# EAGLE design Nano_gies (EAGLE 7.1.0)
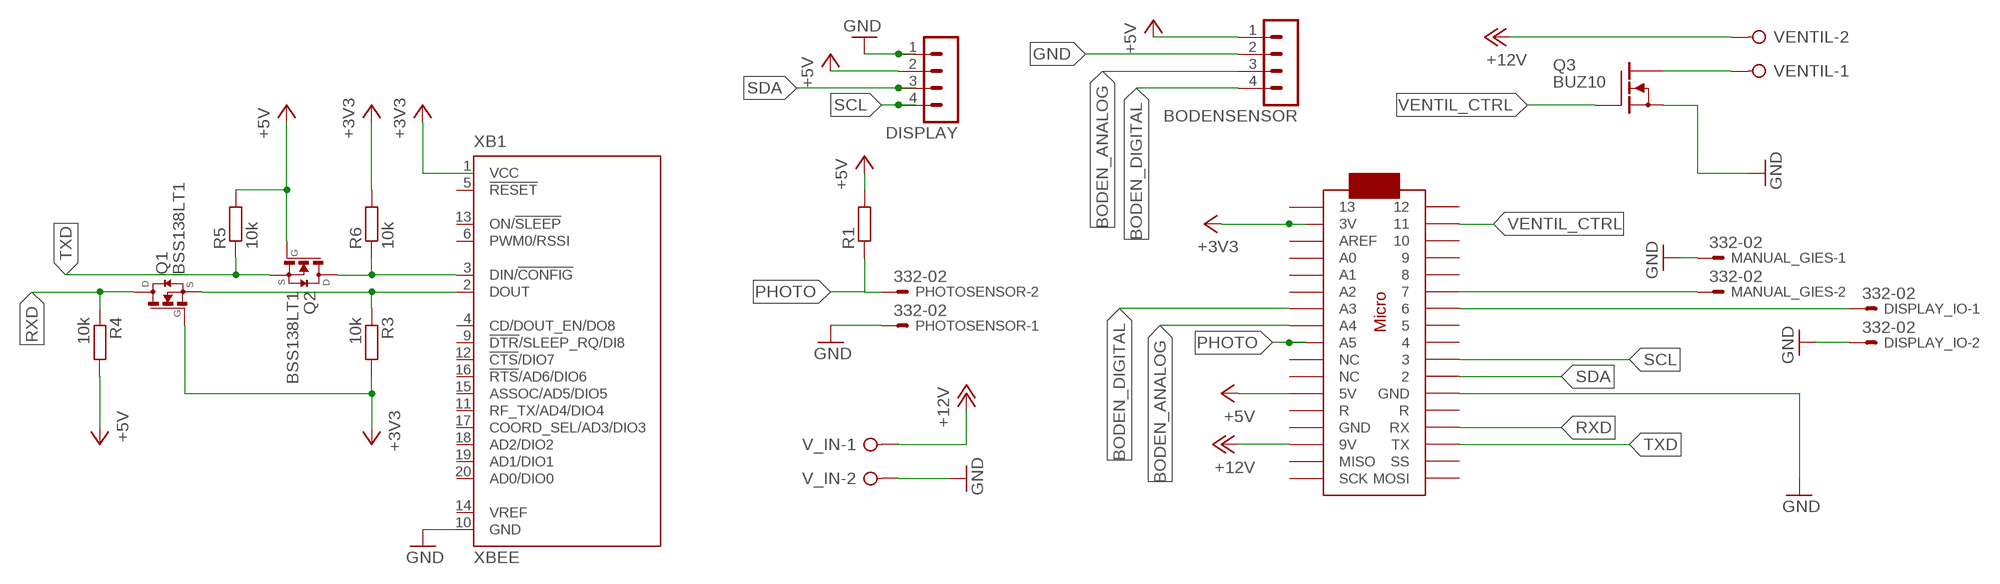
[diagram p0: schematic, sheet 1]

## Parts
BODENSENSOR  MA04-1  [MA04-1]
DISPLAY  MA04-1  [MA04-1]
DISPLAY_IO  332-02  [332-02]
MANUAL_GIES  332-02  [332-02]
PHOTOSENSOR  332-02  [332-02]
Q1  BSS138LT1  [SOT23]
Q2  BSS138LT1  [SOT23]
Q3  BUZ10  [TO220]
R1  R-EU_M0805  [M0805]
R3  10k  R-EU_M0805  [M0805]
R4  10k  R-EU_M0805  [M0805]
R5  10k  R-EU_M0805  [M0805]
R6  10k  R-EU_M0805  [M0805]
U$1  ARDUINOMICRO  [ARDUINOMICRO]
V_IN  W237-02P  [W237-132]
VENTIL  W237-02P  [W237-132]
XB1  XBEE  [XBEE]

## Nets
+3V3: Q1.1(G) R3.2 R6.2 U$1.P$33(3V) XB1.1(VCC)
+5V: BODENSENSOR.1 DISPLAY.2 Q2.1(G) R1.2 R4.2 R5.2 U$1.P$23(5V)
+12V: U$1.P$20(9V) V_IN.1 VENTIL.2
BODEN_ANALOG: BODENSENSOR.3 U$1.P$27(A4)
BODEN_DIGITAL: BODENSENSOR.4 U$1.P$28(A3)
GND: BODENSENSOR.2 DISPLAY.1 DISPLAY_IO.2 MANUAL_GIES.1 PHOTOSENSOR.1 Q3.3(S) U$1.P$21(GND) V_IN.2 XB1.10(GND)
N$1: MANUAL_GIES.2 U$1.P$6
N$2: Q1.2(S) R3.1 XB1.2(DOUT)
N$3: DISPLAY_IO.1 U$1.P$7
N$5: Q3.2(D) VENTIL.1
N$7: Q2.3(D) R6.1 XB1.3(DIN/!CONFIG)
PHOTO: PHOTOSENSOR.2 R1.1 U$1.P$26(A5)
RXD: Q1.3(D) R4.1 U$1.P$14(RX)
SCL: DISPLAY.4 U$1.P$10
SDA: DISPLAY.3 U$1.P$11
TXD: Q2.2(S) R5.1 U$1.P$15(TX)
VENTIL_CTRL: Q3.1(G) U$1.P$2
Unconnected: U$1.P$1 U$1.P$3 U$1.P$4 U$1.P$5 U$1.P$8 U$1.P$9 U$1.P$12(GND) U$1.P$13(R) U$1.P$16(SS) U$1.P$17(MOSI) U$1.P$18(SCK) U$1.P$19(MISO) U$1.P$22(R) U$1.P$24(NC) U$1.P$25(NC) U$1.P$29(A2) U$1.P$30(A1) U$1.P$31(A0) U$1.P$32(AREF) U$1.P$34 XB1.4(CD/DOUT_EN/DO8) XB1.5(!RESET) XB1.6(PWM0/RSSI) XB1.9(!DTR!/SLEEP_RQ/DI8) XB1.11(RF_TX/AD4/DIO4) XB1.12(!CTS!/DIO7) XB1.13(ON/!SLEEP) XB1.14(VREF) XB1.15(ASSOC/AD5/DIO5) XB1.16(!RTS!/AD6/DIO6) XB1.17(COORD_SEL/AD3/DIO3) XB1.18(AD2/DIO2) XB1.19(AD1/DIO1) XB1.20(AD0/DIO0)

## Library data of the parts
BODENSENSOR DISPLAY = con-lstb:MA04-1: PIN HEADER; OC_FARNELL: unknown; OC_NEWARK: unknown
DISPLAY_IO MANUAL_GIES PHOTOSENSOR = con-garry:332-02: 2 Pin - 2mm Dual Row Source: www.mpe-connector.de / garry_shortform_2012.pdf
Q1 Q2 = transistor-fet:BSS138*: Power MOSFET
Q3 = transistor-fet:BUZ10: N-Channel Enhancement MOSFET
R1 R3-R6 = rcl:R-EU_: RESISTOR, European symbol
U$1 = adafruit:ARDUINOMICRO
V_IN VENTIL = con-wago-508:W237-02P: WAGO SREW CLAMP; OC_FARNELL: unknown; OC_NEWARK: unknown
XB1 = maxstream:XBEE: XBee (TM) /XBee-PRO(TM) OEM RF Modules Source: MaxStream, Inc. xbee_productmanual.pdf; MPN: XBP24-Z7UIT-004; OC_FARNELL: 1751799; OC_NEWARK: 34R5507

## Board
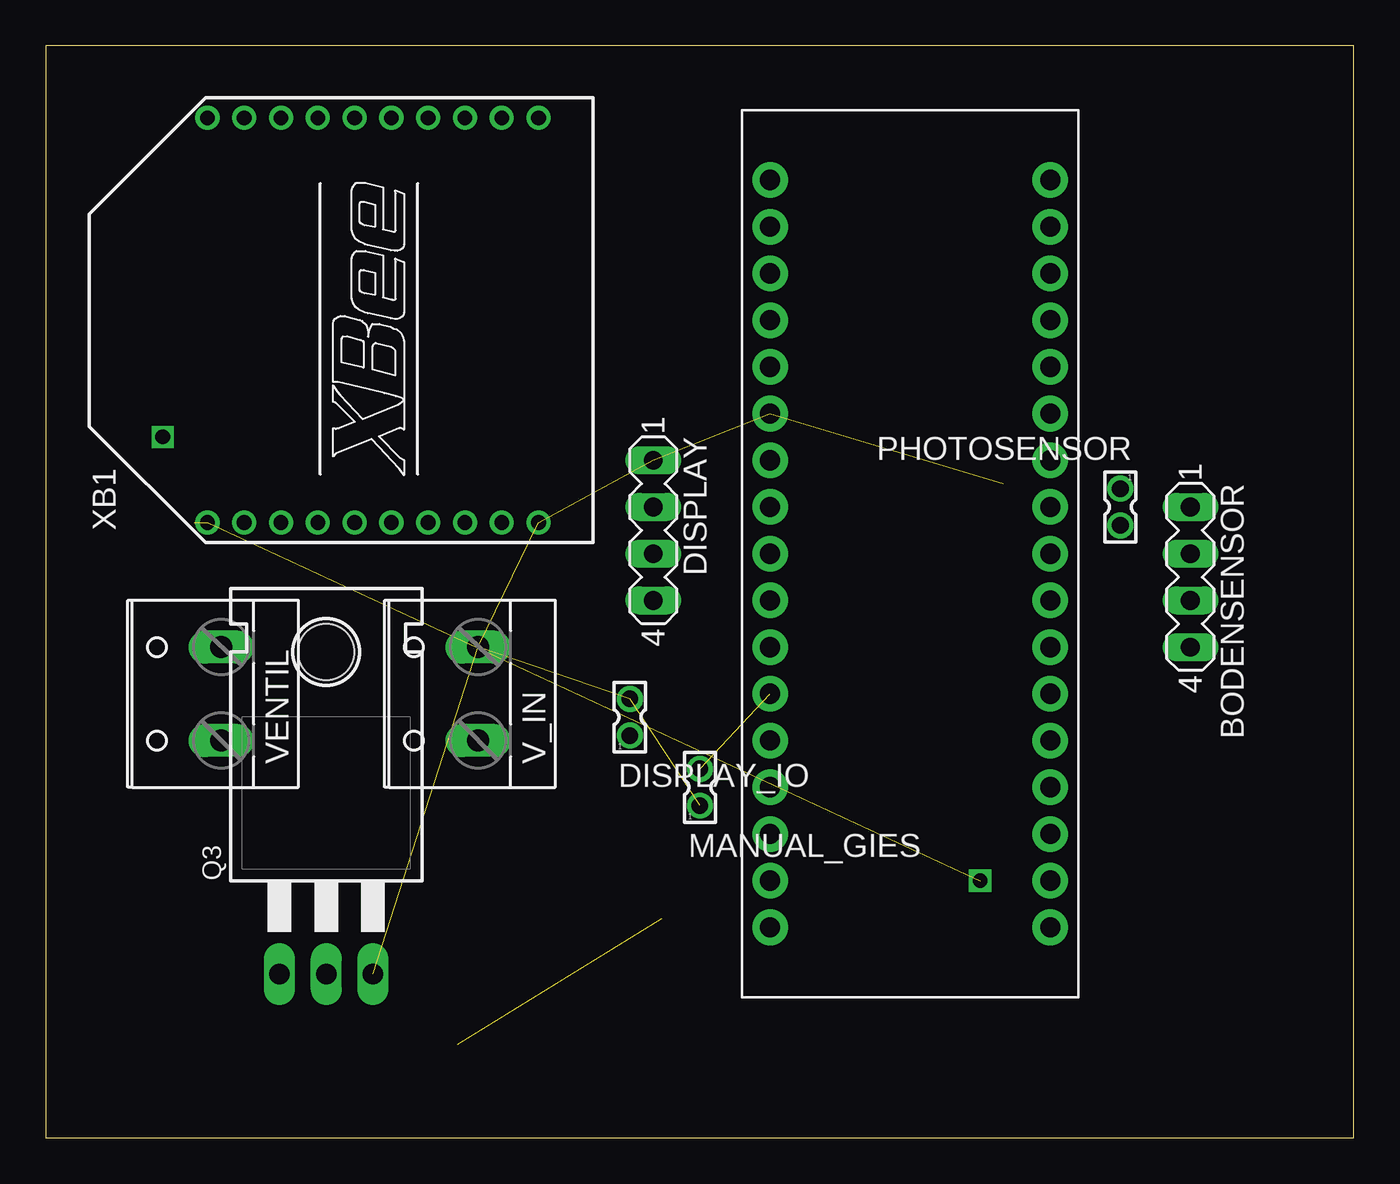
[diagram p1: board, top side]
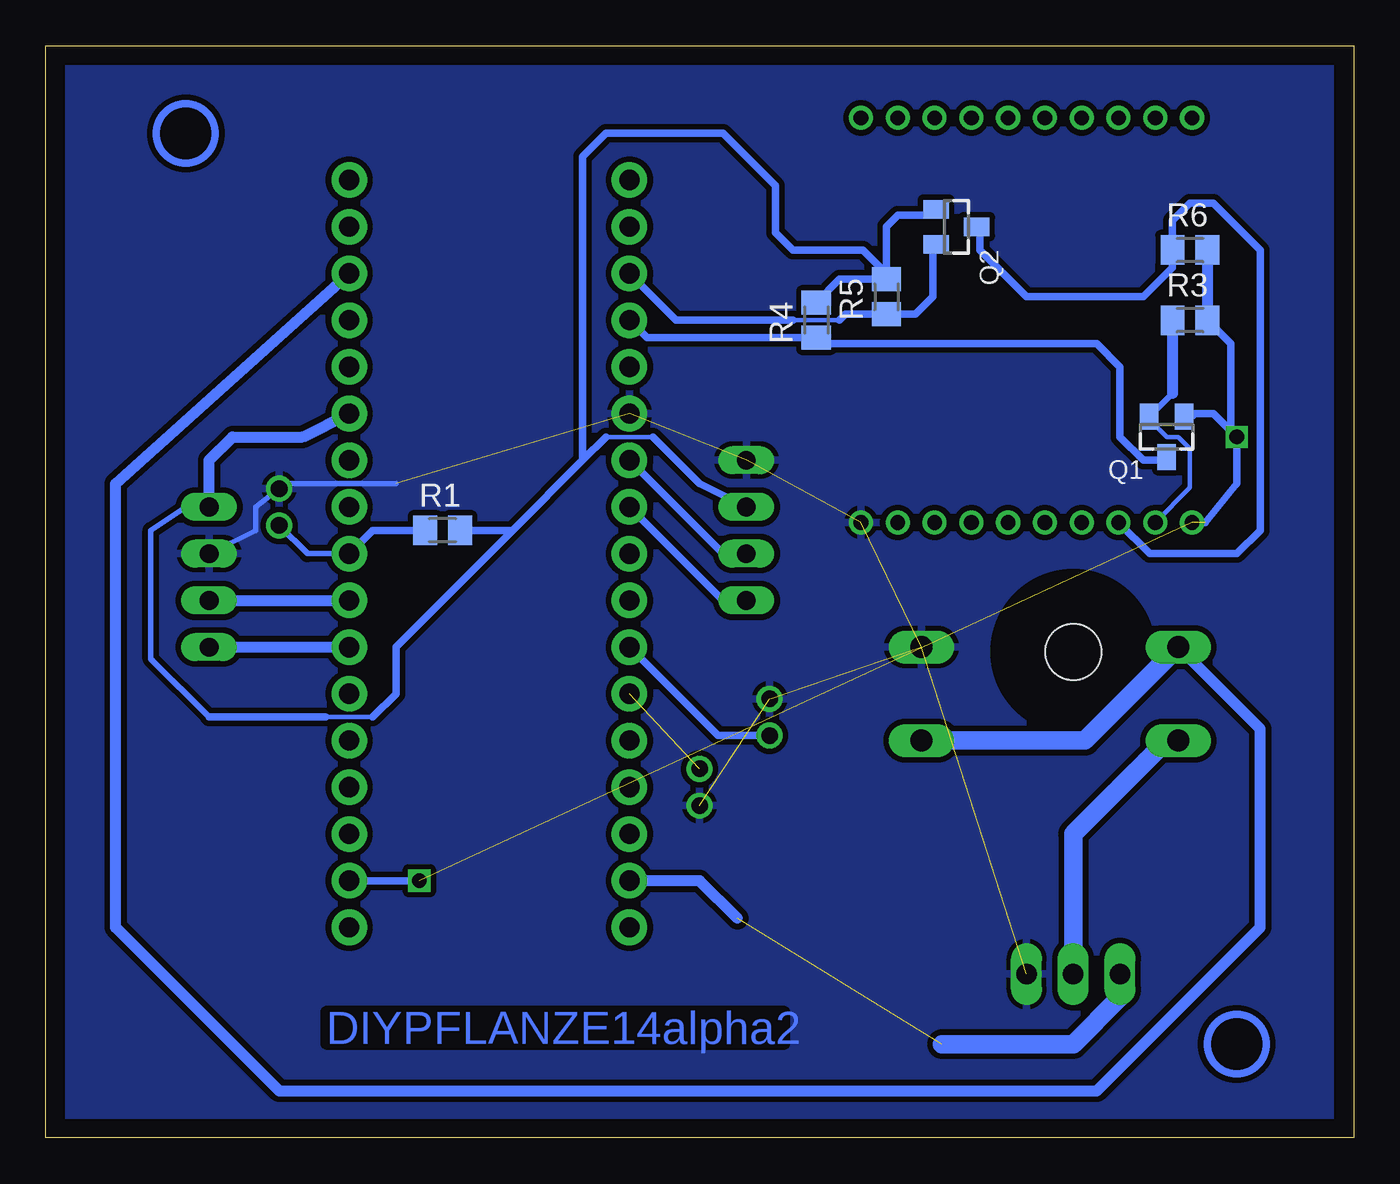
[diagram p2: board, bottom side, seen from below]

Size 71.1 x 59.36 mm. Coordinates in mm from the lower left corner, seen from the top.
Outline: 0,0 71.1,0 71.1,59.36 0,59.36 0,0
Copper layers (1*16): Top 0.035mm / dielectric 1.5mm / Bottom 0.035mm
Design rules "default": minimum track width 10mil, minimum drill 24mil, track to track 8mil, track to pad 8mil, pad to pad 8mil, via to via 8mil, smd to smd 8mil, copper to edge 40mil, drill to drill 8mil, minimum pad ring 10mil, minimum via ring 8mil, stop-mask expansion 4mil, vias tented up to drill 0mil, thermal gap 10mil

### Footprints (pad centres in the part's own frame; a part is rotated, then mirrored left to right if it is on the bottom)
MA04-1 = drill 1.016 long: 1 -3.81,0; 2 -1.27,0; 3 1.27,0; 4 3.81,0
332-02 = drill 0.9 pad 1.27: 1 0,-1; 2 0,1
SOT23 = smd 1 x 1.4: 1 -0.95,-1.1; 2 0.95,-1.1; 3 0,1.1
TO220 = drill 1.118 long: 1 -2.54,-6.35; 2 0,-6.35; 3 2.54,-6.35 | hole 3.048: 0,11.176
M0805 = smd 1.3 x 1.6: 1 -0.95,0; 2 0.95,0
ARDUINOMICRO = drill 1.1 pad 1.93: P$1 -20.32,7.62; P$2 -17.78,7.62; P$3 -15.24,7.62; P$4 -12.7,7.62; P$5 -10.16,7.62; P$6 -7.62,7.62; P$7 -5.08,7.62; P$8 -2.54,7.62; P$9 0,7.62; P$10 2.54,7.62; P$11 5.08,7.62; P$12 12.7,-7.62; P$13 10.16,-7.62; P$14 12.7,7.62; P$15 15.24,7.62; P$16 17.78,7.62; P$17 20.32,7.62; P$18 20.32,-7.62; P$19 17.78,-7.62; P$20 15.24,-7.62; P$21 7.62,7.62; P$22 10.16,7.62; P$23 7.62,-7.62; P$24 5.08,-7.62; P$25 2.54,-7.62; P$26 0,-7.62; P$27 -2.54,-7.62; P$28 -5.08,-7.62; P$29 -7.62,-7.62; P$30 -10.16,-7.62; P$31 -12.7,-7.62; P$32 -15.24,-7.62; P$33 -17.78,-7.62; P$34 -20.32,-7.62
W237-132 = drill 1.194 long: 1 -2.54,-0.635; 2 2.54,-0.635
XBEE = drill 0.8 pad 1.27: 1 -11,9; 2 -11,7; 3 -11,5; 4 -11,3; 5 -11,1; 6 -11,-1; 7 -11,-3; 8 -11,-5; 9 -11,-7; 10 -11,-9; 11 11,-9; 12 11,-7; 13 11,-5; 14 11,-3; 15 11,-1; 16 11,1; 17 11,3; 18 11,5; 19 11,7; 20 11,9

### Placement (x,y rotation side)
BODENSENSOR  62.23,30.48 270 top
DISPLAY  33.02,33.02 270 top
DISPLAY_IO  31.75,22.86 0 top
MANUAL_GIES  35.56,19.05 0 top
PHOTOSENSOR  58.42,34.29 180 top
Q1  10.16,38.1 180 bottom
Q2  21.59,49.53 270 bottom
Q3  15.24,15.24 0 top
R1  49.53,33.02 0 bottom
R3  8.89,44.45 0 bottom
R4  29.21,44.45 90 bottom
R5  25.4,45.72 90 bottom
R6  8.89,48.26 0 bottom
U$1  46.99,31.75 90 top
V_IN  22.86,24.13 90 top
VENTIL  8.89,24.13 90 top
XB1  17.78,44.45 90 top

### Tracks (layer width: path | path; a pad name or v marks a point on that pad's centre or on a via)
+3V3  (via drill 0.8 pad 0.1)  (2 unrouted)
  Bottom 0.305: Q1.1 8.72,39.2
  Bottom 0.406: 8.05,33.45 6.35,35.56 v6.35,38.1 6.67,38.1 6.67,38.42 | 6.67,38.42 6.67,43.18 R3.2 | 6.67,38.42 7.62,39.37 9.04,39.37 Q1.1 | U$1.P$33 v50.8,13.97
  Bottom 0.61: R6.2 R3.2
+5V
  Bottom 0.254: 38.1,38.1 40.64,38.1 | 53.34,22.86 55.88,22.86
  Bottom 0.305: 28.89,45.72 R4.2 | 62.23,22.86 65.41,26.03 65.41,33.02 63.5,34.29 BODENSENSOR.1
  Bottom 0.406: R4.2 27.94,46.67 R5.2 25.4,46.99 | DISPLAY.2 35.56,35.56 38.1,38.1 | 41.91,36.83 41.91,53.34 40.64,54.61 34.29,54.61 31.43,51.75 31.43,49.21 30.48,48.26 26.67,48.26 25.4,46.99 | 41.91,36.83 40.64,38.1 | 53.34,22.86 52.07,24.13 52.07,26.67 45.72,33.02 | 55.88,22.86 62.23,22.86 | 45.72,33.02 41.91,36.83 | R1.2 45.72,33.02 | 25.4,46.99 25.4,49.53 24.76,50.16 23,50.16 Q2.1
  Bottom 0.61: BODENSENSOR.1 62.23,36.83 60.96,38.1 57.15,38.1 U$1.P$23
+12V
  Bottom 0.406: V_IN.1 22.86,21.59
  Bottom 0.61: U$1.P$20 67.31,35.56 67.31,11.43 58.42,2.54 13.97,2.54 5.08,11.43 5.08,22.22 VENTIL.2
  Bottom 1.016: V_IN.1 14.61,21.59 VENTIL.2
BODEN_ANALOG
  Bottom 0.61: BODENSENSOR.3 U$1.P$27
BODEN_DIGITAL
  Bottom 0.61: BODENSENSOR.4 U$1.P$28
GND  (7 unrouted)
  Bottom 0.305: PHOTOSENSOR.1 59.69,34.29 59.69,33.02 BODENSENSOR.2 | 58.15,35.56 52.07,35.56
  Bottom 0.406: PHOTOSENSOR.1 58.15,35.56
  pour Bottom (isolate 0.305): 1.27,58.42 69.85,58.42 69.85,0 1.27,0
N$1  (1 unrouted)
N$2
  Bottom 0.254: Q1.2 11.11,39.05 10.16,38.1 9.53,38.1 8.89,37.46 8.89,35.34 XB1.2
  Bottom 0.305: Q1.2 9.84,40.47
  Bottom 0.61: R3.1 9.84,40.47
N$3
  Bottom 0.406: DISPLAY_IO.1 34.56,21.86 U$1.P$7
N$5
  Bottom 1.016: VENTIL.1 10.16,21.59 15.24,16.51 Q3.2
N$7
  Bottom 0.406: XB1.3 11.08,31.75 6.35,31.75 5.08,33.02 5.08,48.26 7.62,50.8 8.89,50.8 9.84,49.85 R6.1 9.84,47.31 11.43,45.72 17.78,45.72 20.32,48.26 20.32,49.36 Q2.3
PHOTO
  Bottom 0.305: U$1.P$26 56.88,31.75 PHOTOSENSOR.2
  Bottom 0.406: U$1.P$26 53.34,33.02 R1.1
RXD
  Bottom 0.406: Q1.3 10.16,36.83 11.43,36.83 12.7,38.1 12.7,41.91 13.97,43.18 28.89,43.18 R4.1 38.42,43.5 U$1.P$14
SCL
  Bottom 0.406: DISPLAY.4 34.29,29.21 U$1.P$10
SDA
  Bottom 0.406: DISPLAY.3 34.29,31.75 U$1.P$11
TXD
  Bottom 0.254: 27.94,44.45 30.48,44.45
  Bottom 0.406: Q2.2 22.86,48.41 22.86,45.72 23.81,44.77 R5.1 27.62,44.77 27.94,44.45 | U$1.P$15 36.83,44.45 30.48,44.45
VENTIL_CTRL  (1 unrouted)
  Bottom 0.61: 33.51,11.92 35.56,13.97 U$1.P$2
  Bottom 1.016: Q3.1 12.7,7.62 15.24,5.08 22.37,5.08
(copper drawn outside any net)
  shapes: Bottom circle x2

### Text on the board
Bottom: DIYPFLANZE14alpha2